# Altium schematic sheet node_simple.SchDoc
size A
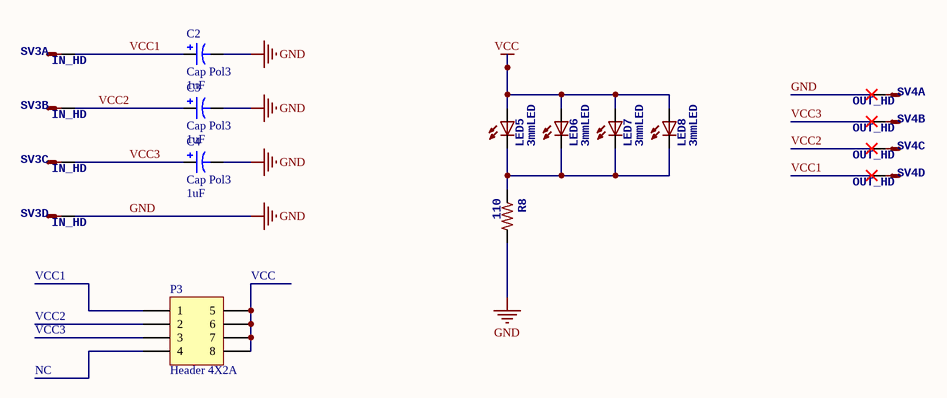
[diagram p0: node_simple.SchDoc]

## Parts
C2  Cap Pol3  value 1uF  [C0805]
C3  Cap Pol3  value 1uF  [C0805]
C4  Cap Pol3  value 1uF  [C0805]
LED5  3mmLED  [LED3MM]
LED6  3mmLED  [LED3MM]
LED7  3mmLED  [LED3MM]
LED8  3mmLED  [LED3MM]
P3  Header 4X2A  [HDR2X4_CEN]
R8  110  [M0805]
SV3  IN_HD  [L04P]  (parts A,B,C,D of 4)
SV4  OUT_HD  [L04P]  (parts A,B,C,D of 4)

## Nets
GND: C2.2 C3.2 C4.2 R8.2 SV3.4(S) SV4.1(S)
VCC: LED5.A LED6.A LED7.A LED8.A
VCC1: C2.1 SV3.1(S) SV4.4(S)
VCC2: C3.1 SV3.2(S) SV4.3(S)
VCC3: C4.1 SV3.3(S) SV4.2(S)
NetLED5_K: LED5.K(C) LED6.K(C) LED7.K(C) LED8.K(C) R8.1
NetP3_5: P3.5 P3.6 P3.7 P3.8

Not connected (* = marked no-connect by the designer): P3 1 2 3 4

## Notes on the sheet
- VCC1
- VCC2
- (near P3) VCC
- VCC3
- NC

## Library data of the parts
C2-C4 = Cap Pol3: Polarized Capacitor (Surface Mount); Published: 8-Jun-2000; LatestRevisionDate: 29-May-2009; LatestRevisionNote: IPC-7351 Footprint Added.; PackageReference: C0805; Publisher: Altium Limited; PackageDescription: Chip Capacitor
LED5-LED8 = LED3MM
P3 = Header 4X2A: Header, 4-Pin, Dual row; LatestRevisionDate: 17-Jul-2002; LatestRevisionNote: Re-released for DXP Platform.; Publisher: Altium Limited
R8 = R-US_M0805: R-M0805; value: 4.7k
SV3 SV4 = L04P: OC_FARNELL: unknown; OC_NEWARK: unknown